# Altium schematic sheet SCH_Altium_OpenComs_ABP1_Back-panel_Jacks_Connectors_2023-05-12.schdoc
size 58 x 53 mm
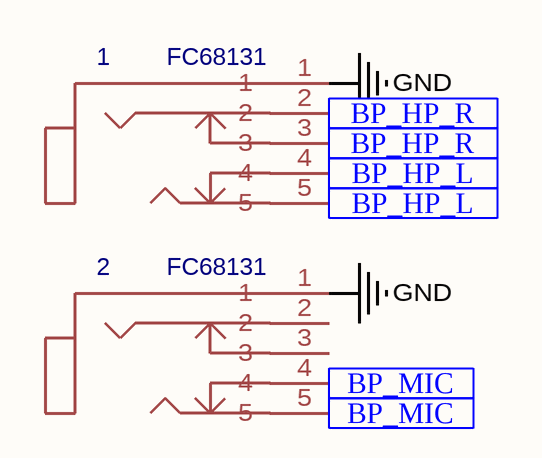
[diagram p0: SCH_Altium_OpenComs_ABP1_Back-panel_Jacks_Connectors_2023-05-12.schdoc]

## Parts
1  FC68131  [FC68131-5P]
2  FC68131  [FC68131-5P]

## Ports
BP_HP_L (in), BP_HP_R (in), BP_MIC (in)

## Nets
GND: 1.1 2.1
BP_HP_L: 1.4 1.5 ; port BP_HP_L
BP_HP_R: 1.2 1.3 ; port BP_HP_R
BP_MIC: 2.4 2.5 ; port BP_MIC

Not connected (* = marked no-connect by the designer): 2 2 3

## Library data of the parts
1 2 = FC68131: Contributor: alefax; spicePre: ?; spiceSymbolName: FC68131